# EAGLE design RAMPSSB (EAGLE 8.2.2)
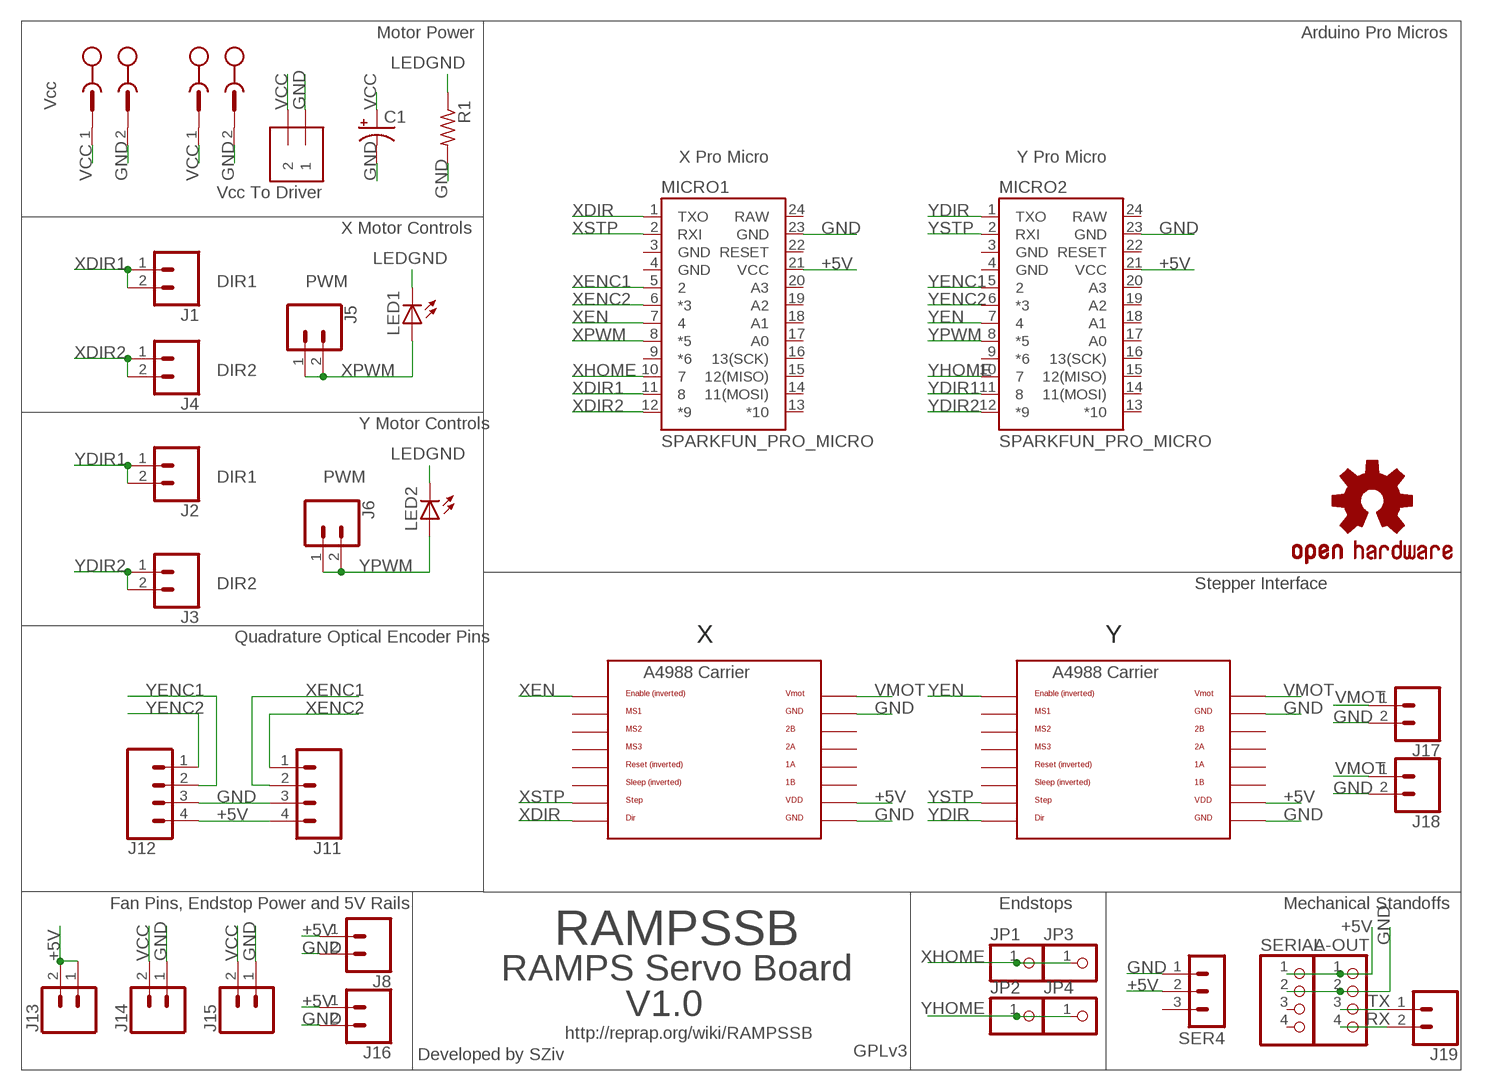
[diagram p0: schematic, sheet 1]

## Parts
A-OUT  PINHD-1X4  [1X04]
C1  CPOL-USE2.5-6  [E2,5-6]
J1  CONN_02  [1X02]
J2  CONN_02  [1X02]
J3  CONN_02  [1X02]
J4  CONN_02  [1X02]
J5  CONN_02  [1X02]
J6  CONN_02  [1X02]
J7  OSTTH020160  [EDSTL130-02]
J8  CONN_02  [1X02]
J9  OSTTH020160  [EDSTL130-02]
J10  1X2-3.5MM  [1X2-3.5MM]
J11  CONN_04  [1X04]
J12  CONN_04  [1X04]
J13  CONN_02  [1X02]
J14  CONN_02  [1X02]
J15  CONN_02  [1X02]
J16  CONN_02  [1X02]
J17  CONN_02  [1X02]
J18  CONN_02  [1X02]
J19  CONN_02  [1X02]
JP1  PINHD-1X1  [1X01]
JP2  PINHD-1X1  [1X01]
JP3  PINHD-1X1  [1X01]
JP4  PINHD-1X1  [1X01]
LED1  LED3MM  [LED3MM]
LED2  LED3MM  [LED3MM]
LOGO1  OSHW-LOGOL  [OSHW-LOGO-L]
MICRO1  SPARKFUN_PRO_MICRO  [SPARKFUN_PRO_MICRO]
MICRO2  SPARKFUN_PRO_MICRO  [SPARKFUN_PRO_MICRO]
R1  R-US_0207/7  [0207/7]
SER4  3PIN-HEADER  [3PIN-HEADER]
SERIAL  PINHD-1X4  [1X04]
U$6  A4988BREAKOUT  [A4988BREAKOUT]
U$7  A4988BREAKOUT  [A4988BREAKOUT]

## Nets
+5V: A-OUT.1 J8.1 J11.4 J12.4 J13.1 J13.2 J16.1 MICRO1.21(VCC) MICRO2.21(VCC) SER4.2 SERIAL.1 U$6.VDD U$7.VDD
GND: A-OUT.2 C1.- J7.2 J8.2 J9.2 J10.1 J11.3 J12.3 J14.1 J15.1 J16.2 J17.2 J18.2 MICRO1.23(GND) MICRO2.23(GND) R1.2 SER4.1 SERIAL.2 U$6.GND U$6.GND@0(GND) U$7.GND U$7.GND@0(GND)
LEDGND: LED1.K(C) LED2.K(C) R1.1
RX: A-OUT.4 J19.2
TX: A-OUT.3 J19.1
VCC: C1.+ J7.1 J9.1 J10.2 J14.2 J15.2
VMOT: J17.1 J18.1 U$6.VMOT U$7.VMOT
XDIR: MICRO1.1(TXO) U$6.DIR
XDIR1: J1.1 J1.2 MICRO1.11
XDIR2: J4.1 J4.2 MICRO1.12(*9)
XEN: MICRO1.7 U$6.EN
XENC1: J11.2 MICRO1.5
XENC2: J11.1 MICRO1.6(*3)
XHOME: JP1.1 JP3.1 MICRO1.10
XPWM: J5.1 J5.2 LED1.A MICRO1.8(*5)
XSTP: MICRO1.2(RXI) U$6.STEP
YDIR: MICRO2.1(TXO) U$7.DIR
YDIR1: J2.1 J2.2 MICRO2.11
YDIR2: J3.1 J3.2 MICRO2.12(*9)
YEN: MICRO2.7 U$7.EN
YENC1: J12.2 MICRO2.5
YENC2: J12.1 MICRO2.6(*3)
YHOME: JP2.1 JP4.1 MICRO2.10
YPWM: J6.1 J6.2 LED2.A MICRO2.8(*5)
YSTP: MICRO2.2(RXI) U$7.STEP
Unconnected: MICRO1.9(*6) MICRO1.13(*10) MICRO1.14(11(MOSI)) MICRO1.15(12(MISO)) MICRO1.16(13(SCK)) MICRO1.17(A0) MICRO1.18(A1) MICRO1.19(A2) MICRO1.20(A3) MICRO1.22(RESET) MICRO2.9(*6) MICRO2.13(*10) MICRO2.14(11(MOSI)) MICRO2.15(12(MISO)) MICRO2.16(13(SCK)) MICRO2.17(A0) MICRO2.18(A1) MICRO2.19(A2) MICRO2.20(A3) MICRO2.22(RESET) SER4.3 SERIAL.3 SERIAL.4 U$6.1A U$6.1B U$6.2A U$6.2B U$6.MS1 U$6.MS2 U$6.MS3 U$6.RST U$6.SLP(SLEEP) U$7.1A U$7.1B U$7.2A U$7.2B U$7.MS1 U$7.MS2 U$7.MS3 U$7.RST U$7.SLP(SLEEP)

## Notes on the sheet
- Motor Power | Arduino Pro Micros
- Vcc
- X Pro Micro | Y Pro Micro
- Vcc To Driver
- X Motor Controls
- DIR1 | PWM
- DIR2
- Y Motor Controls
- DIR1 | PWM
- DIR2 | Stepper Interface
- Quadrature Optical Encoder Pins | X | Y
- Fan Pins, Endstop Power and 5V Rails | Endstops | Mechanical Standoffs
- RAMPSSB
- RAMPS Servo Board
- V1.0
- http://reprap.org/wiki/RAMPSSB
- Developed by SZiv | GPLv3

## Power pins joined to a net without a drawn wire
GND: MICRO1.3(GND) MICRO1.4(GND) MICRO2.3(GND) MICRO2.4(GND)
RAW: MICRO1.24(RAW) MICRO2.24(RAW)

## Library data of the parts
A-OUT SERIAL = RepRapjr:PINHD-1X4: PIN HEADER
C1 = adafruit:CPOL-US: POLARIZED CAPACITOR, American symbol
J1-J6 J8 J13-J19 = SparkFun-Retired:CONN_02: Multi connection point. Often used as Generic Header-pin footprint for 0.1 inch spaced/style header connections On any of the 0.1 inch spaced packages, you can populate with these: Break Away Headers - Straight <https://www.sparkfun.com/products/116> (PRT-00116) Break Away Male Headers - Right Angle <https://www.sparkfun.com/products/553> (PRT-00553) Female Headers <https://www.sparkfun.com/products/115> (PRT-00115) Break Away Headers - Machine Pin <https://www.sparkfun.com/products/117> (PRT-00117) Break Away Female Headers - Swiss Machine Pin <https://www.sparkfun.com/products/743> (PRT-00743) For SCREWTERMINALS and SPRING TERMINALS visit here: Screw Terimnals on SparkFun.com <https://www.sparkfun.com/search/results?term=Screw+Terminals> (5mm/3.5mm/2.54mm spacing) This device is also useful as a general connection point to wire up your design to another part of your project. Our various solder wires solder well into these plated through hole pads. Hook-Up Wire - Assortment (Stranded, 22 AWG) <https://www.sparkfun.com/products/11375> (PRT-11375) Hook-Up Wire - Assortment (Solid Core, 22 AWG) <https://www.sparkfun.com/products/11367> (PRT-11367) View the entire wire category on our website here <https://www.sparkfun.com/categories/141> Special notes: Molex polarized connector foot print use with: PRT-08233 with associated crimp pins and housings. 2.54_SCREWTERM for use with PRT-10571. 3.5mm Screw Terminal footprints for PRT-08084 5mm Screw Terminal footprints for use with PRT-08432
J7 J9 = con-ost:OSTTH020160: 5mm Terminal Header
J10 = adafruit:1X2: 3.5mm Terminal block http://www.ladyada.net/library/pcb/eaglelibrary.html
J11 J12 = SparkFun-Connectors:CONN_04: Multi connection point. Often used as Generic Header-pin footprint for 0.1 inch spaced/style header connections On any of the 0.1 inch spaced packages, you can populate with these: Break Away Headers - Straight <https://www.sparkfun.com/products/116> (PRT-00116) Break Away Male Headers - Right Angle <https://www.sparkfun.com/products/553> (PRT-00553) Female Headers <https://www.sparkfun.com/products/115> (PRT-00115) Break Away Headers - Machine Pin <https://www.sparkfun.com/products/117> (PRT-00117) Break Away Female Headers - Swiss Machine Pin <https://www.sparkfun.com/products/743> (PRT-00743) For SCREWTERMINALS and SPRING TERMINALS visit here: Screw Terimnals on SparkFun.com <https://www.sparkfun.com/search/results?term=Screw+Terminals> (5mm/3.5mm/2.54mm spacing) This device is also useful as a general connection point to wire up your design to another part of your project. Our various solder wires solder well into these plated through hole pads. Hook-Up Wire - Assortment (Stranded, 22 AWG) <https://www.sparkfun.com/products/11375> (PRT-11375) Hook-Up Wire - Assortment (Solid Core, 22 AWG) <https://www.sparkfun.com/products/11367> (PRT-11367) View the entire wire category on our website here <https://www.sparkfun.com/categories/141> Special notes: Molex polarized connector foot print use with SKU : PRT-08231 with associated crimp pins and housings. 1MM SMD Version SKU: PRT-10208; PROD_ID: CONN-09696
JP1-JP4 = adafruit:PINHD-1X1: Pin header 1x1 for 0.1" spacing With round pins
LED1 LED2 = adafruit:LED: LED OSRAM: - CHIPLED LG R971, LG N971, LY N971, LG Q971, LY Q971, LO R971, LY R971 LH N974, LH R974 LS Q976, LO Q976, LY Q976 LO Q996 - Hyper CHIPLED LW Q18S LB Q993, LB Q99A, LB R99A - SideLED LS A670, LO A670, LY A670, LG A670, LP A670 LB A673, LV A673, LT A673, LW A673 LH A674 LY A675 LS A676, LA A676, LO A676, LY A676, LW A676 LS A679, LY A679, LG A679 - Hyper Micro SIDELED® LS Y876, LA Y876, LO Y876, LY Y876 LT Y87S - SmartLED LW L88C, LW L88S LB L89C, LB L89S, LG L890 LS L89K, LO L89K, LY L89K LS L896, LA L896, LO L896, LY L896 - TOPLED LS T670, LO T670, LY T670, LG T670, LP T670 LSG T670, LSP T670, LSY T670, LOP T670, LYG T670 LG T671, LOG T671, LSG T671 LB T673, LV T673, LT T673, LW T673 LH T674 LS T676, LA T676, LO T676, LY T676, LB T676, LH T676, LSB T676, LW T676 LB T67C, LV T67C, LT T67C, LS T67K, LO T67K, LY T67K, LW E67C LS E67B, LA E67B, LO E67B, LY E67B, LB E67C, LV E67C, LT E67C LW T67C LS T679, LY T679, LG T679 LS T770, LO T770, LY T770, LG T770, LP T770 LB T773, LV T773, LT T773, LW T773 LH T774 LS E675, LA E675, LY E675, LS T675 LS T776, LA T776, LO T776, LY T776, LB T776 LHGB T686 LT T68C, LB T68C - Hyper Mini TOPLED® LB M676 - Mini TOPLED Santana® LG M470 LS M47K, LO M47K, LY M47K Source: http://www.osram.convergy.de/
LOGO1 = SparkFun-Aesthetics:OSHW-LOGO: Open-Source Hardware (OSHW) Logo This logo indicates the piece of hardware it is found on incorporates a OSHW license and/or adheres to the definition of open source hardware found here: http://freedomdefined.org/OSHW
MICRO1 MICRO2 = SparkFun-Boards:SPARKFUN_PRO_MICRO: SparkFun Pro Micro Atmega32U4 compatible footprint. SparkFun Products: 3.3V/8MHz <https://www.sparkfun.com/products/12587> 5V/16MHz <https://www.sparkfun.com/products/12640>
R1 = adafruit:R-US_: RESISTOR, American symbol
SER4 = ultimachine:3PIN-HEADER: PIN HEADER
U$6 U$7 = RepRapjr:A4988BREAKOUT

## Board
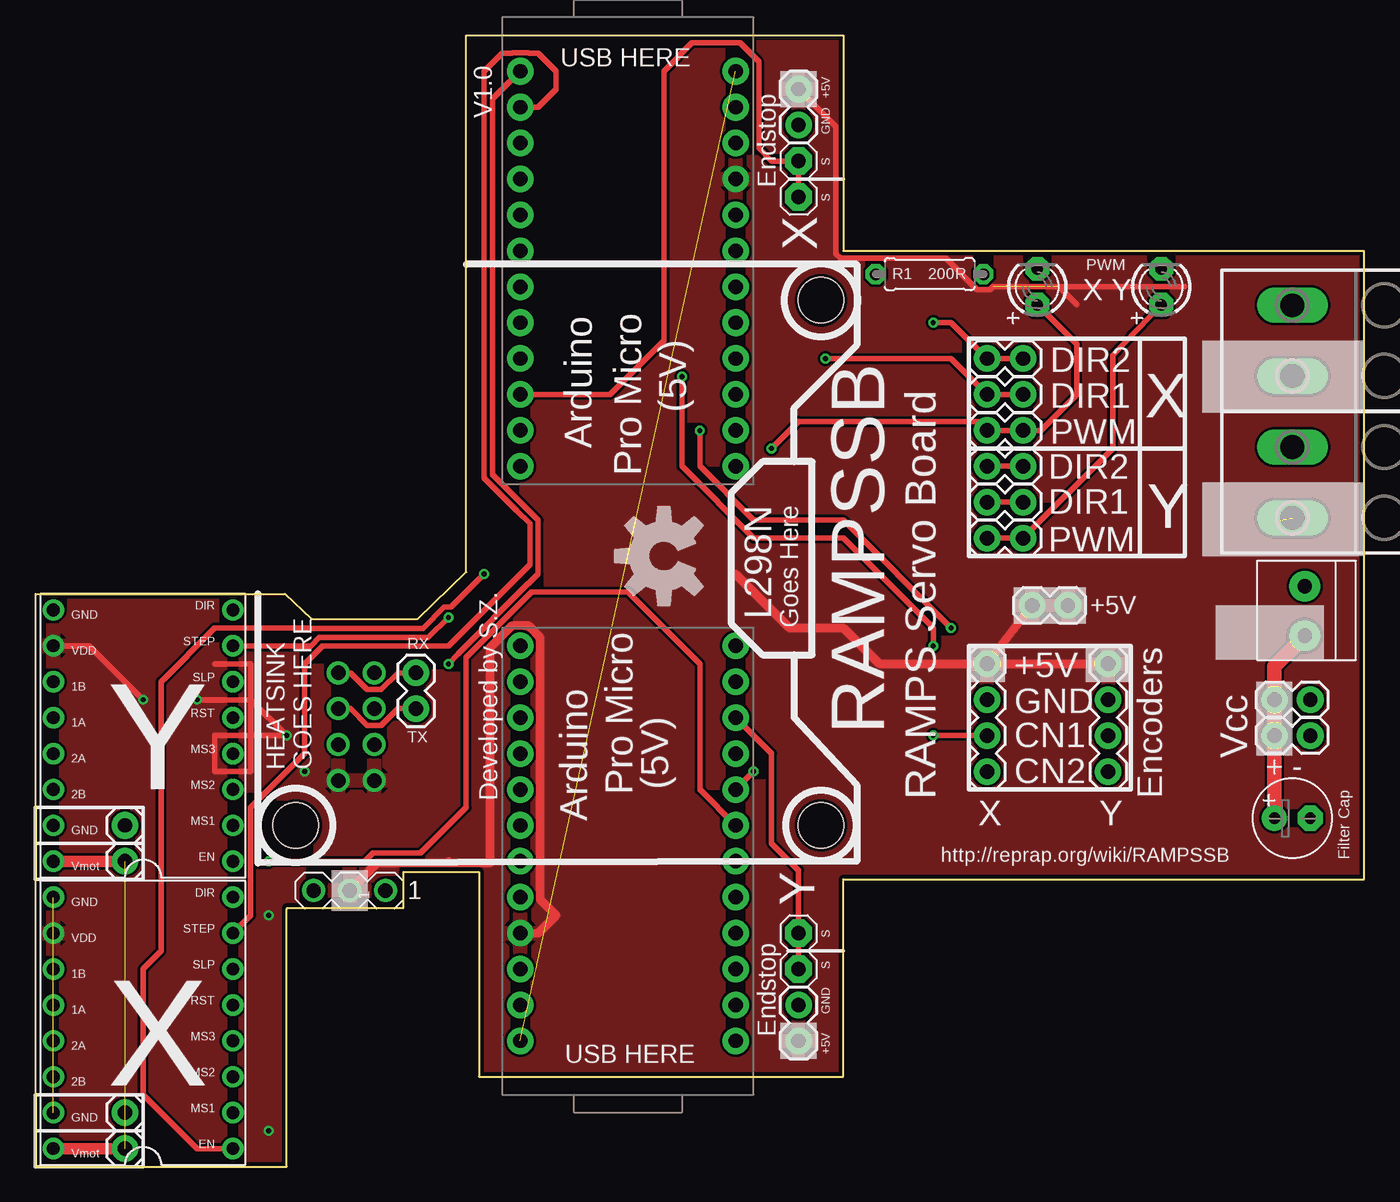
[diagram p1: board, top side]
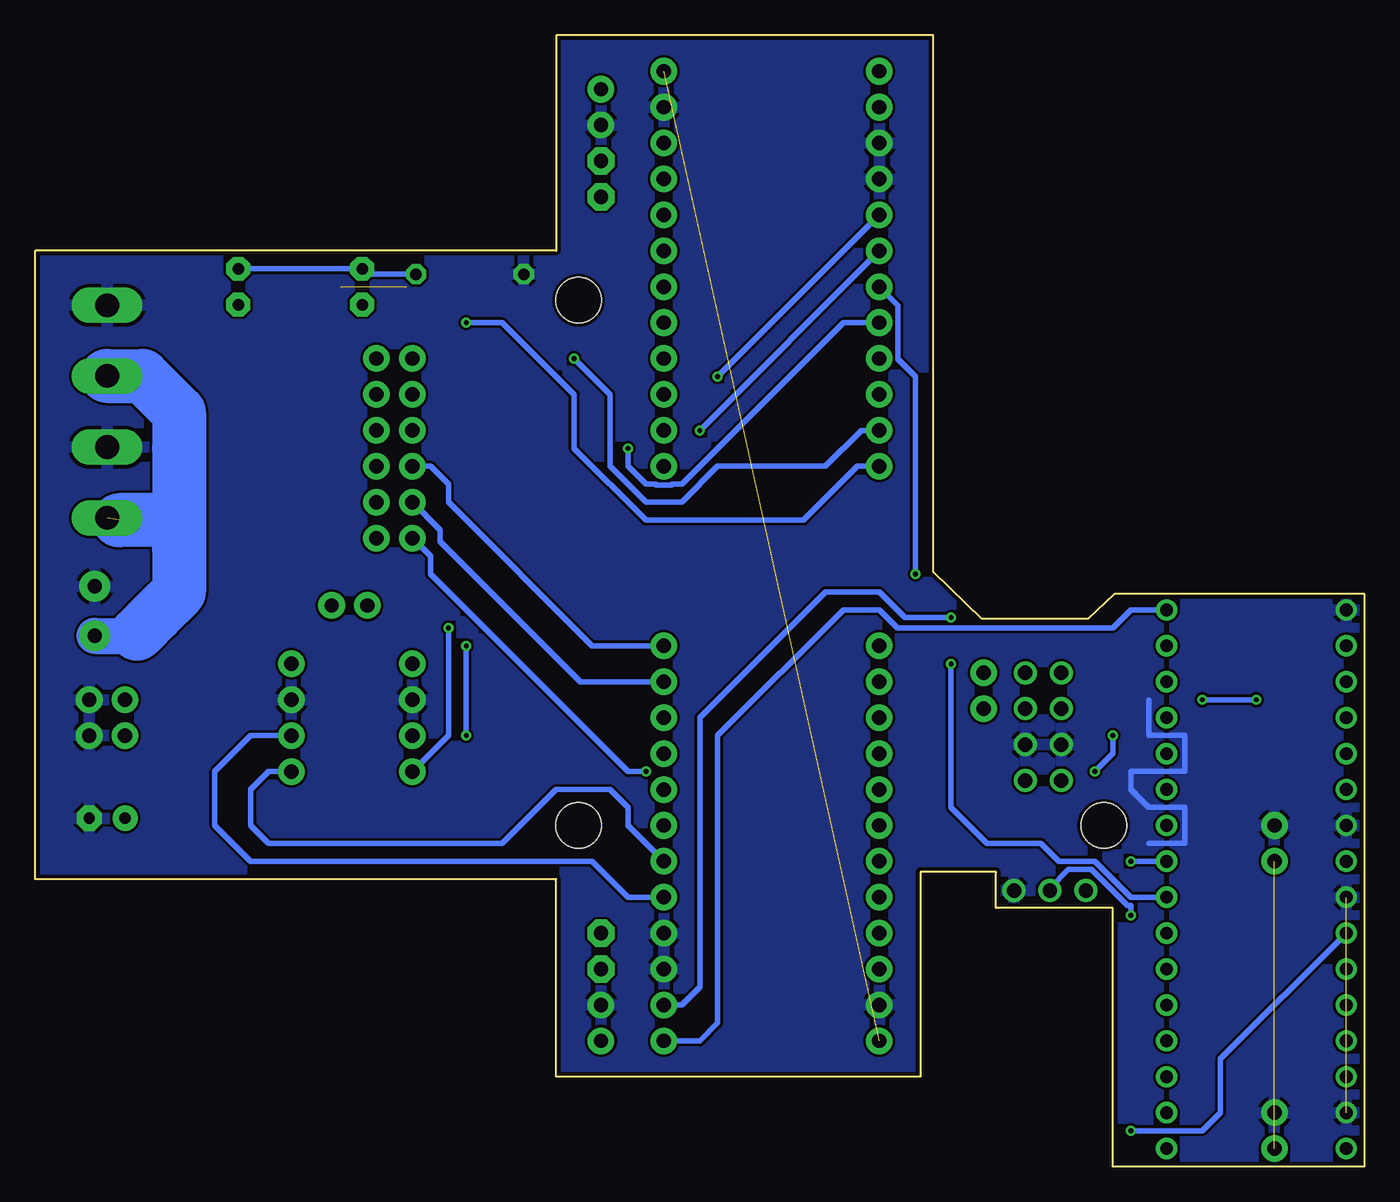
[diagram p2: board, bottom side, seen from below]

Size 93.98 x 80.01 mm. Coordinates in mm from the lower left corner, seen from the top.
Outline: 17.78,18.23 17.78,0 0,0 0,40.51 17.65,40.51 19.56,38.73 27.05,38.73 30.48,42.04 30.48,80.01 57.15,80.01 57.15,64.77 93.98,64.77 93.98,20.32 57.15,20.32 57.15,6.35 31.37,6.35 31.37,20.83 26.04,20.83 26.04,18.29 17.78,18.29
Copper layers (1*16): Top 0.035mm / dielectric 1.5mm / Bottom 0.035mm
Design rules "GoldPhoenix": minimum track width 7mil, minimum drill 15mil, track to track 7mil, track to pad 7mil, pad to pad 7mil, via to via 7mil, smd to smd 7mil, copper to edge 10mil, drill to drill 8mil, minimum pad ring 12mil, minimum via ring 7mil, stop-mask expansion 4mil, vias tented up to drill 25mil, thermal gap 10mil
Holes 3.2 mm at 18.41,24.13 55.56,24.13 55.56,61.28

### Footprints (pad centres in the part's own frame; a part is rotated, then mirrored left to right if it is on the bottom)
1X04 = drill 1.016: 1 -2.54,0; 2 0,0; 3 2.54,0; 4 5.08,0
E2,5-6 = drill 0.813 pad 1.778: + -1.27,0 | drill 0.813 pad 1.778 octagon: - 1.27,0
1X02 = drill 1.016 pad 1.88: 1 0,0; 2 2.54,0
EDSTL130-02 = drill 1.676 long: 1 -2.5,0; 2 2.5,0
1X2-3.5MM = drill 1 pad 2.184: 1 1.8,0; 2 -1.7,0
1X04' = drill 1.016 pad 1.88: 1 0,0; 2 2.54,0; 3 5.08,0; 4 7.62,0
1X01 = drill 1.016 pad 1.93 octagon: 1 0,0
LED3MM = drill 0.813 pad 1.676 octagon: A -1.27,0; K 1.27,0
SPARKFUN_PRO_MICRO = drill 1.016 pad 1.88: 1 -7.62,12.7; 2 -7.62,10.16; 3 -7.62,7.62; 4 -7.62,5.08; 5 -7.62,2.54; 6 -7.62,0; 7 -7.62,-2.54; 8 -7.62,-5.08; 9 -7.62,-7.62; 10 -7.62,-10.16; 11 -7.62,-12.7; 12 -7.62,-15.24; 13 7.62,-15.24; 14 7.62,-12.7; 15 7.62,-10.16; 16 7.62,-7.62; 17 7.62,-5.08; 18 7.62,-2.54; 19 7.62,0; 20 7.62,2.54; 21 7.62,5.08; 22 7.62,7.62; 23 7.62,10.16; 24 7.62,12.7
0207/7 = drill 0.813 octagon: 1 -3.81,0; 2 3.81,0
3PIN-HEADER = drill 1.016: 1 -2.54,0; 2 0,0; 3 2.54,0
A4988BREAKOUT = drill 0.9: 1A 8.89,1.27; 1B 11.43,1.27; 2A 6.35,1.27; 2B 3.81,1.27; DIR 16.51,-11.43; EN -1.27,-11.43; GND 16.51,1.27; GND@0 1.27,1.27; MS1 1.27,-11.43; MS2 3.81,-11.43; MS3 6.35,-11.43; RST 8.89,-11.43; SLP 11.43,-11.43; STEP 13.97,-11.43; VDD 13.97,1.27; VMOT -1.27,1.27

### Placement (x,y rotation side)
A-OUT  21.43,29.84 90 top
C1  88.9,24.64 0 top
J1  67.31,54.61 0 top
J2  67.31,46.99 0 top
J3  67.31,49.53 0 top
J4  67.31,57.15 0 top
J5  67.31,52.07 0 top
J6  67.31,44.45 0 top
J7  88.9,58.42 90 top
J8  53.98,8.89 90 top
J9  88.9,48.39 90 top
J10  89.79,39.24 90 top
J11  [1X04']  67.31,27.94 90 top
J12  [1X04']  75.88,27.94 90 top
J13  73.03,39.69 180 top
J14  90.17,33.02 180 top
J15  90.17,30.48 180 top
J16  53.98,76.2 270 top
J17  6.35,1.27 90 top
J18  6.35,21.59 90 top
J19  26.92,32.38 90 top
JP1  53.98,71.12 0 top
JP2  53.98,16.51 0 top
JP3  53.98,68.58 0 top
JP4  53.98,13.97 0 top
LED1  70.87,62.23 90 top
LED2  79.63,62.23 90 top
LOGO1  44.45,43.18 90 top
MICRO1  41.91,64.77 0 top
MICRO2  41.91,21.59 180 top
R1  63.25,63.12 180 top
SER4  22.23,19.53 180 top
SERIAL  23.97,29.84 90 top
U$6  2.54,2.54 90 top
U$7  2.54,22.86 90 top

### Tracks (layer width: path | path; a pad name or v marks a point on that pad's centre or on a via)
+5V  (via drill 0.35)  (1 unrouted)
  Top 0.406: J11.4 67.11,35.56 | SER4.2 22.23,19.69 24.13,21.59 | U$7.VDD 3.81,36.83 v7.62,33.02 | v11.43,33.02 15.24,33.02 v17.78,30.48 12.7,30.48 12.7,27.94 15.24,27.94 15.24,35.56 12.7,35.56 | J16.1 56.62,73.56 56.62,64.55 56.93,64.24 64.39,64.24 66.6,62.03 67.51,62.03 67.71,62.23 81.28,62.23 | 72.39,62.23 73.66,60.96
  Top 0.61: J12.4 J11.4 67.11,35.56 59.69,35.56 57.15,38.1 53.34,38.1 49.53,41.91 | J11.4 J13.2 | SER4.2 24.17,21.49 29.11,21.49 | 29.21,21.59 29.11,21.49 | MICRO2.21 35.56,16.51 36.83,17.78 35.71,18.9 35.71,37.42 34.88,38.25 33.7,38.25 32.18,36.73 32.18,21.49 29.11,21.49
  Bottom 0.406: U$6.VDD | U$6.VDD 10.16,7.62 10.16,3.81 11.43,2.54 v16.51,2.54 | SER4.2 22.23,19.69 20.9,21.01 19.29,21.01 16.75,18.47 16.51,18.47 v16.51,17.78 | v17.78,30.48 17.78,29.21 v19.05,27.94 | v7.62,33.02 v11.43,33.02
  pour Top: 0,0 0,41.91 15.56,41.91 26.99,42.23 30.48,45.72 30.48,80.01 57.15,80.01 57.15,66.04 93.98,66.04 93.98,20.32 57.15,20.32 57.15,6.35 26.04,5.08 27.3,17.78 17.78,17.78 17.78,0
GND  (1 unrouted)
  Bottom 0.406: 15.24,33.02 15.24,30.48 12.7,30.48 12.7,27.94 16.51,27.94 16.51,26.67 15.24,25.4 12.7,25.4 12.7,22.86 15.24,22.86
  pour Bottom: 0,0 0,41.91 15.88,41.91 27.3,42.55 30.48,45.72 30.48,80.01 57.15,80.01 57.15,66.04 93.98,66.04 93.98,20.32 57.15,20.32 57.15,5.08 30.48,5.08 27.3,9.53 27.3,17.15 26.67,17.78 17.78,17.78 17.78,0
LEDGND
  Top 0.406: 79.5,63.5 LED2.K | R1.1 67.31,63.37
  Bottom 0.305: 69.85,63.12 R1.1 | 69.85,63.12 70.48,63.12 LED1.K | 70.75,63.12 69.85,63.12
  Bottom 0.406: R1.1 70.48,63.12 LED1.K LED2.K 71.13,63.5 70.75,63.12
RAW  (1 unrouted)
RX
  Top 0.406: A-OUT.4 22.28,34.92 23.48,33.73 24.47,33.73 25.66,34.92 J19.2
TX
  Top 0.406: A-OUT.3 22.28,32.38 23.48,31.19 24.47,31.19 25.66,32.38 J19.1
VCC  (1 unrouted)
  Top 1.016: C1.+ J15.2 J14.2 87.63,35.38 J10.2
  Bottom 2.54: J10.2 86.92,37.54 85.43,39.03 | 83.82,50.8 83.82,53.34
  Bottom 3.81: 86.79,37.67 85.43,39.03 83.82,40.64 83.82,43.71 | 83.82,43.71 83.82,45.72 | 83.82,45.72 88.06,45.72 | 83.82,50.8 83.82,45.72 | J7.1 86.4,55.92 83.82,53.34 83.82,43.71
VMOT  (1 unrouted)
  Top 0.813: U$6.VMOT J17.1 | J17.1 | U$7.VMOT J18.1
XDIR  (via drill 0.35)
  Top 0.406: MICRO1.1 32.33,75.51 32.33,48.93 34.28,46.99 34.29,46.99 35.56,45.72 35.56,41.91 34.87,41.22 34.86,41.22 29.9,36.26 29.9,36.25 v29.21,35.56
  Bottom 0.406: U$6.DIR 16.51,19.05 19.05,21.59 21.59,21.59 22.86,22.86 26.67,22.86 29.21,25.4 v29.21,35.56
XDIR1  (via drill 0.35)
  Top 0.406: J1.2 J1.1 64.77,57.15 v55.88,57.15
  Bottom 0.406: MICRO1.11 35.56,52.07 38.1,49.53 45.72,49.53 48.26,46.99 50.8,46.99 53.34,49.53 53.34,54.61 v55.88,57.15
XDIR2  (via drill 0.35)
  Top 0.406: J4.2 J4.1 64.77,59.69 v63.5,59.69
  Bottom 0.406: v63.5,59.69 60.96,59.69 55.88,54.61 55.88,50.8 50.8,45.72 39.65,45.72 35.84,49.53 MICRO1.12
XEN  (via drill 0.35)
  Top 0.406: U$6.EN 11.43,1.27 7.62,5.08 7.62,13.97 8.89,15.24 8.89,34.29 12.7,38.1 19.31,38.1 19.34,38.07 27.41,38.07 28.91,39.57 29.41,39.57 v31.75,41.91
  Bottom 0.406: MICRO1.7 32.97,60.91 32.97,57.1 31.75,55.88 v31.75,41.91
XENC1  (via drill 0.35)
  Top 0.406: J11.2 v63.5,30.48 | v63.5,36.83 63.5,38.1 57.15,44.45 50.8,44.45 45.72,49.53 v45.72,55.88
  Bottom 0.406: v63.5,30.48 v63.5,36.83 | v45.72,55.88 MICRO1.5
XENC2  (via drill 0.35)
  Top 0.406: v64.77,38.1 57.15,45.72 50.8,45.72 46.99,49.53 v46.99,52.07
  Bottom 0.406: v64.77,38.1 64.77,30.48 J11.1 | MICRO1.6 v46.99,52.07
XHOME
  Top 0.406: MICRO1.10 40.64,54.61 44.45,58.42 44.45,77.47 46.46,79.48 49.82,79.48 51.17,78.13 51.17,72.02 52.07,71.12 JP1.1 JP3.1
XPWM  (via drill 0.35)
  Top 0.406: v52.07,50.8 53.98,52.7 66.67,52.7 J5.1 J5.2 71.12,52.07 73.66,54.61 73.66,58.17 LED1.A
  Bottom 0.406: MICRO1.8 36.83,59.69 48.26,48.26 48.93,48.26 48.98,48.21 50.08,48.21 50.13,48.26 50.8,48.26 52.07,49.53 v52.07,50.8
XSTP
  Top 0.406: U$6.STEP 15.24,17.78 15.24,25.4 19.05,29.21 19.05,35.56 20.32,36.83 29.21,36.83 34.98,42.6 34.98,45.48 34.05,46.41 34.04,46.41 31.75,48.69 31.75,77.47 33.02,78.74 33.69,78.74 33.74,78.79 34.84,78.79 34.89,78.74 35.56,78.74 36.83,77.47 36.83,76.2 35.56,74.93 MICRO1.2
YDIR
  Bottom 0.406: MICRO2.1 46.99,8.89 45.72,10.16 45.72,30.48 36.83,39.37 34.29,39.37 33.02,38.1 17.78,38.1 16.51,39.37 U$7.DIR
YDIR1
  Top 0.406: J2.2 J2.1
  Bottom 0.406: MICRO2.11 55.44,34.29 65.35,44.21 65.35,45.03 J2.1
YDIR2
  Top 0.406: J3.2 J3.1
  Bottom 0.406: MICRO2.12 54.61,36.83 64.77,46.99 64.77,48.26 66.04,49.53 J3.1
YEN  (via drill 0.35)
  Top 0.406: MICRO2.7 46.99,26.67 46.99,35.56 41.91,40.64 35.1,40.64 30.48,36.02 30.48,25.4 27.25,22.17 23.89,22.17 23.3,21.59 v16.51,21.59
  Bottom 0.406: U$7.EN v16.51,21.59
YENC1
  Bottom 0.406: MICRO2.5 52.07,19.05 54.61,21.59 78.74,21.59 81.28,24.13 81.28,27.94 78.74,30.48 J12.2
YENC2
  Bottom 0.406: J12.1 77.47,27.94 78.74,26.67 78.74,24.13 77.47,22.86 60.96,22.86 57.15,26.67 53.34,26.67 52.07,25.4 52.07,24.13 MICRO2.6
YHOME
  Top 0.406: MICRO2.10 52.07,29.21 52.07,22.86 53.98,20.95 JP2.1 JP4.1
YPWM  (via drill 0.35)
  Top 0.406: J6.1 J6.2 76.2,50.8 76.2,57.4 LED2.A | MICRO2.8 v50.8,27.94
  Bottom 0.406: v50.8,27.94 52.07,27.94 66.04,41.91 66.04,43.18 J6.1
YSTP  (via drill 0.35)
  Top 0.406: v29.21,38.83 27.79,37.41 20.08,37.41 19.49,36.83 U$7.STEP
  Bottom 0.406: MICRO2.2 48.26,11.43 46.99,12.7 46.99,31.75 38.1,40.64 34.29,40.64 32.48,38.83 v29.21,38.83

### Text on the board
tPlace: USB HERE | Endstop | +5V | V1.0 | GND | S | S | X | PWM | R1 | 200R | X Y | DIR2 | X | (5V) | DIR1 | Arduino | PWM | Pro Micro | DIR2 | Y | DIR1 | PWM | Developed by S.Z. | L298N | +5V | Pro Micro | Goes Here | RX | +5V | GND | RAMPSSB | TX | CN1 | Vcc | HEATSINK / GOES HERE | + - | Y | (5V) | CN2 | RAMPS Servo Board | Encoders | Arduino | X | Y | http://reprap.org/wiki/RAMPSSB | Filter Cap | Y | S | S | GND | Endstop | USB HERE | +5V | X
_tsilk: 1